# Altium schematic sheet TopLevel.SCHDOC
size A4
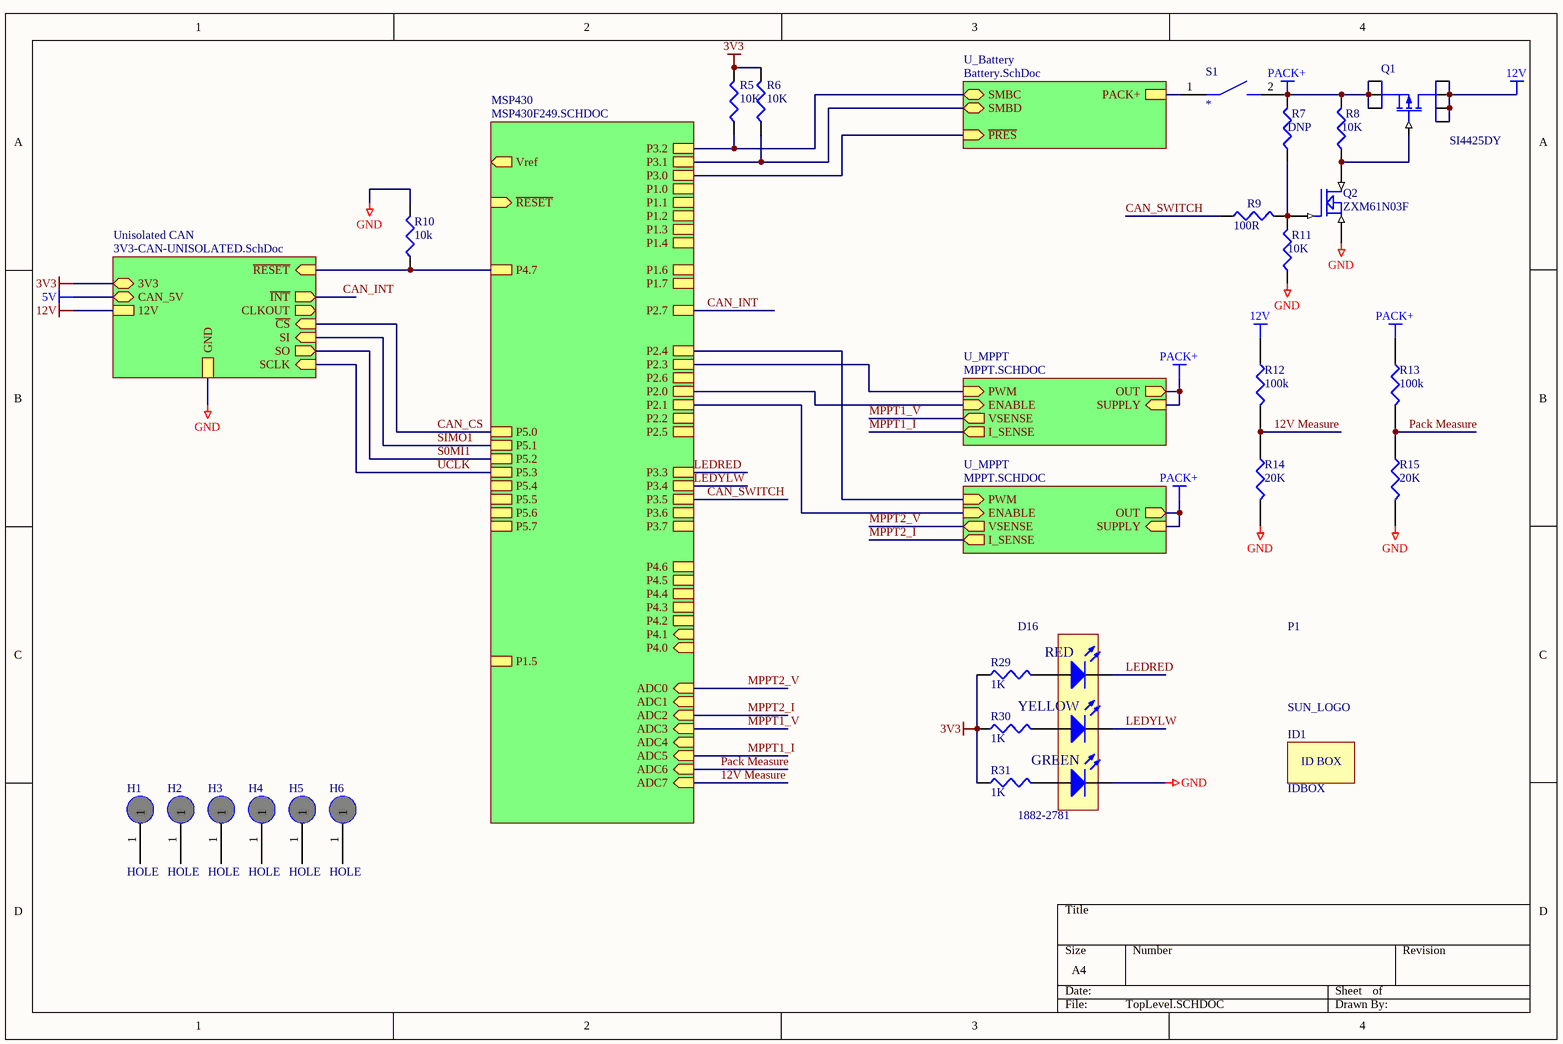
[diagram p0: TopLevel.SCHDOC]

## Parts
D16  1882-2781  [LED_TRILEVEL]
H1  HOLE  [M3]
H2  HOLE  [M3]
H3  HOLE  [M3]
H4  HOLE  [M3]
H5  HOLE  [M3]
H6  HOLE  [M3]
ID1  IDBOX  [IDBOX]
P1  SUN_LOGO  [SUNSWIFTLOGO]
Q1  SI4425DY  [SO8]
Q2  ZXM61N03F  [SOT23(3)]
R5  10K  [0603]
R6  10K  [0603]
R7  DNP  [0603]
R8  10K  [0603]
R9  100R  [0603]
R10  10k  [0603]
R11  10K  [0603]
R12  100k  [1206]
R13  100k  [1206]
R14  20K  [1206]
R15  20K  [1206]
R29  1K  [0603]
R30  1K  [0603]
R31  1K  [0603]
S1  *

## Sub-sheets
MSP430 = MSP430F249.SCHDOC: ADC0 (in), ADC1 (in), ADC2 (in), ADC3 (in), ADC4 (in), ADC5 (in), ADC6 (in), ADC7 (in), P1.0, P1.1, P1.2, P1.3, P1.4, P1.5, P1.6, P1.7, P2.0, P2.1, P2.2, P2.3, P2.4, P2.5, P2.6, P2.7, P3.0, P3.1, P3.2, P3.3, P3.4, Vref (out), ~{RESET} (in), P3.5, P3.6, P3.7, P4.0 (in), P4.1 (in), P4.2, P4.3, P4.4, P4.5, P4.6, P4.7, P5.0, P5.1, P5.2, P5.3, P5.4, P5.5, P5.6, P5.7
U_Battery = Battery.SchDoc: SMBD (bidir), SMBC (bidir), PACK+, ~{PRES} (in)
U_MPPT = MPPT.SCHDOC: ENABLE (in), OUT (out), VSENSE (out), PWM (in), I_SENSE (out), SUPPLY (in)
U_MPPT = MPPT.SCHDOC: ENABLE (in), OUT (out), VSENSE (out), PWM (in), I_SENSE (out), SUPPLY (in)
Unisolated CAN = 3V3-CAN-UNISOLATED.SchDoc: SI (in), SO (out), ~{CS} (in), SCLK (in), ~{INT} (out), ~{RESET} (in), 12V, GND, 3V3 (bidir), CLKOUT (out), CAN_5V (bidir)

## Nets
3V3: R5.2 R6.2 R29.1 R30.1 R31.1 ; sheet Unisolated CAN/3V3
5V: sheet Unisolated CAN/CAN_5V
12V: Q1.5(D) Q1.6(D) Q1.7(D) Q1.8(D) R12.1 ; sheet Unisolated CAN/12V
GND: D16.1(K) Q2.2(S) R10.2 R11.1 R14.2 R15.2 ; sheet Unisolated CAN/GND
PACK+: Q1.1(S) Q1.2(S) Q1.3(S) R7.2 R8.2 R13.1 S1.2 ; sheet U_MPPT/OUT, sheet U_MPPT/SUPPLY, sheet U_MPPT/OUT, sheet U_MPPT/SUPPLY
12V Measure: R12.2 R14.1 ; sheet MSP430/ADC7
CAN_CS: sheet Unisolated CAN/~{CS}, sheet MSP430/P5.0
CAN_INT: sheet Unisolated CAN/~{INT}, sheet MSP430/P2.7
CAN_SWITCH: R9.1 ; sheet MSP430/P3.5
LEDRED: D16.3(K) ; sheet MSP430/P3.3
LEDYLW: D16.2(K) ; sheet MSP430/P3.4
MPPT1_I: sheet MSP430/ADC5, sheet U_MPPT/I_SENSE
MPPT1_V: sheet MSP430/ADC3, sheet U_MPPT/VSENSE
MPPT2_I: sheet MSP430/ADC2, sheet U_MPPT/I_SENSE
MPPT2_V: sheet MSP430/ADC0, sheet U_MPPT/VSENSE
Pack Measure: R13.2 R15.1 ; sheet MSP430/ADC6
S0MI1: sheet Unisolated CAN/SO, sheet MSP430/P5.2
SIMO1: sheet Unisolated CAN/SI, sheet MSP430/P5.1
UCLK: sheet Unisolated CAN/SCLK, sheet MSP430/P5.3
NetD16_4: D16.4(A) R29.2
NetD16_5: D16.5(A) R30.2
NetD16_6: D16.6(A) R31.2
NetQ1_4: Q1.4(G) Q2.3(D) R8.1
NetQ2_1: Q2.1(G) R7.1 R9.2 R11.2
NetR5_1: R5.1 ; sheet MSP430/P3.2, sheet U_Battery/SMBC
NetR6_1: R6.1 ; sheet MSP430/P3.1, sheet U_Battery/SMBD
NetR10_1: R10.1 ; sheet Unisolated CAN/~{RESET}, sheet MSP430/P4.7
NetS1_1: S1.1 ; sheet U_Battery/PACK+
(unnamed): sheet MSP430/P2.0, sheet U_MPPT/ENABLE
(unnamed): sheet MSP430/P2.1, sheet U_MPPT/ENABLE
(unnamed): sheet MSP430/P2.3, sheet U_MPPT/PWM
(unnamed): sheet MSP430/P2.4, sheet U_MPPT/PWM
(unnamed): sheet MSP430/P3.0, sheet U_Battery/~{PRES}

Not connected (* = marked no-connect by the designer): H1 1; H2 1; H3 1; H4 1; H5 1; H6 1

## Notes on the sheet
- (in symbol IDBOX) ID BOX
- (in symbol LED-TRILEVEL) RED; YELLOW; GREEN

## Library data of the parts
D16 = LED-TRILEVEL: Three level LED; Order#: 1461596; Price: 3.29; Supplier: Farnell
H1-H6 = HOLE: Order#: NA; Supplier: NA; Price: NA
Q1 = SI4425DY: SI4425DY P Channel Mosfet; Order#: 1057875; Price: 2.91; Supplier: Farnell
Q2 = ZXM61N02F: 1.7A, 20V N-Channel Enhancement mode FET; Order#: 9525289; Price: 0.73; Supplier: Farnell
R5-R8 R10 R11 = RES1: Resistor; Supplier: Stock
R9 = RES1: Supplier: Stock
R12 R13 = RES1: Order#: 308-6422; Price: 1.010; Supplier: Farnell
R14 R15 = RES1: Order#: 308-6252; Price: 1.010; Supplier: Farnell
R29-R31 = RES1: Resistor; Order#: 9331697; Supplier: Farnell; Price: 0.05
S1 = SWITCH: Order#: 108-2282; Price: 13.60; Supplier: Farnell